# Altium project 加速度传感器.PrjPCB
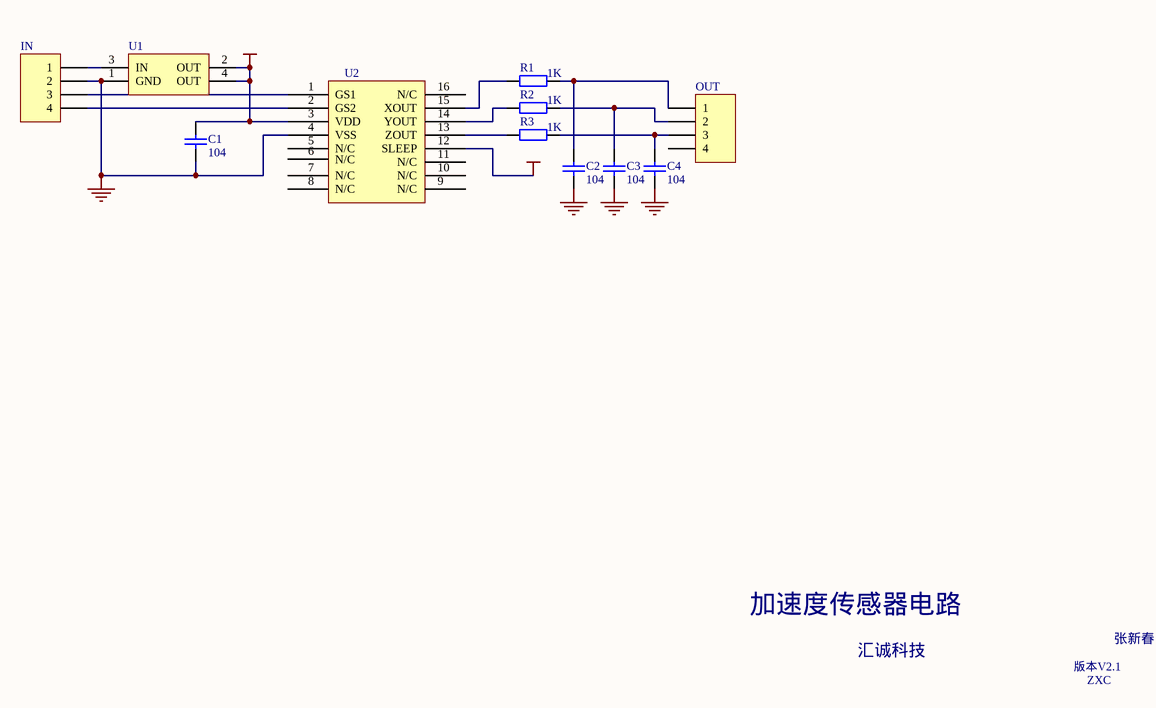
[diagram p0: 加速度传感器.SchDoc]
1 sheet, 11 parts. Net scope: global (net labels, ports and power ports of the same name join across sheets).
Board file: 加速度传感器-fa.PcbDoc

## Sheet 加速度传感器.SchDoc
size A4

### Parts
C1  value 104  [TP-0805-R]  (hidden comment: CPDR)
C2  value 104  [TP-0805-R]  (hidden comment: CPDR)
C3  value 104  [TP-0805-R]  (hidden comment: CPDR)
C4  value 104  [TP-0805-R]  (hidden comment: CPDR)
IN  PZ_4  [HDR-4]  (value not drawn)
OUT  PZ_4  [HDR-4]  (value not drawn)
R1  value 1K  [TP-0805-R]  (hidden comment: Res)
R2  value 1K  [TP-0805-R]  (hidden comment: Res)
R3  value 1K  [TP-0805-R]  (hidden comment: Res)
U1  REG1117-3.3  [ZZ311]  (value not drawn)
U2  MMA7260  [A7260]  (value not drawn)

### Nets
GND: C1.1 C2.1 C3.1 C4.1 IN.2 U1.1(GND) U2.4(VSS)
VCC: C1.2 U1.2(OUT) U1.4(OUT) U2.3(VDD) U2.12(SLEEP)
NetC2_2: C2.2 OUT.1 R1.2
NetC3_2: C3.2 OUT.2 R2.2
NetC4_2: C4.2 OUT.3 R3.2
NetIN_1: IN.1 U1.3(IN)
NetIN_3: IN.3 U2.1(GS1)
NetIN_4: IN.4 U2.2(GS2)
NetR1_1: R1.1 U2.15(XOUT)
NetR2_1: R2.1 U2.14(YOUT)
NetR3_1: R3.1 U2.13(ZOUT)

Not connected (* = marked no-connect by the designer): OUT 4; U2 5(N/C) 6(N/C) 7(N/C) 8(N/C) 9(N/C) 10(N/C) 11(N/C) 16(N/C)

### Notes on the sheet
- 加速度传感器电路
- 汇诚科技
- 版本V2.1
- 张新春
- ZXC

### Library data of the parts
C1-C4 = CPDR: 瓷片电容; Published: 8-Jun-2000; LatestRevisionDate: 17-Jul-2002; LatestRevisionNote: Re-released for DXP Platform.; Publisher: Altium Limited
IN OUT = PZ_4: 排针——4; LatestRevisionDate: 17-Jul-2002; LatestRevisionNote: Re-released for DXP Platform.; Publisher: Altium Limited
R1-R3 = Res: 电阻; Published: 8-Jun-2000; LatestRevisionDate: 17-Jul-2002; LatestRevisionNote: Re-released for DXP Platform.; Publisher: Altium Limited
U1 = REG1117-5: 800mA and 1A Low Dropout Positive Regulator 2.85V, 3.3V, 5V, and Adjustable; PackageDocument: revC; Published: 8-Jun-2000; LatestRevisionDate: 17-Jul-2002; LatestRevisionNote: Re-released for DXP Platform.; DatasheetDocument: Sep-1997; PackageReference: ZZ311; Publisher: Altium Limited